# Altium schematic sheet Sheet1.SchDoc
size A4; SheetNumber: 1; SheetTotal: 1
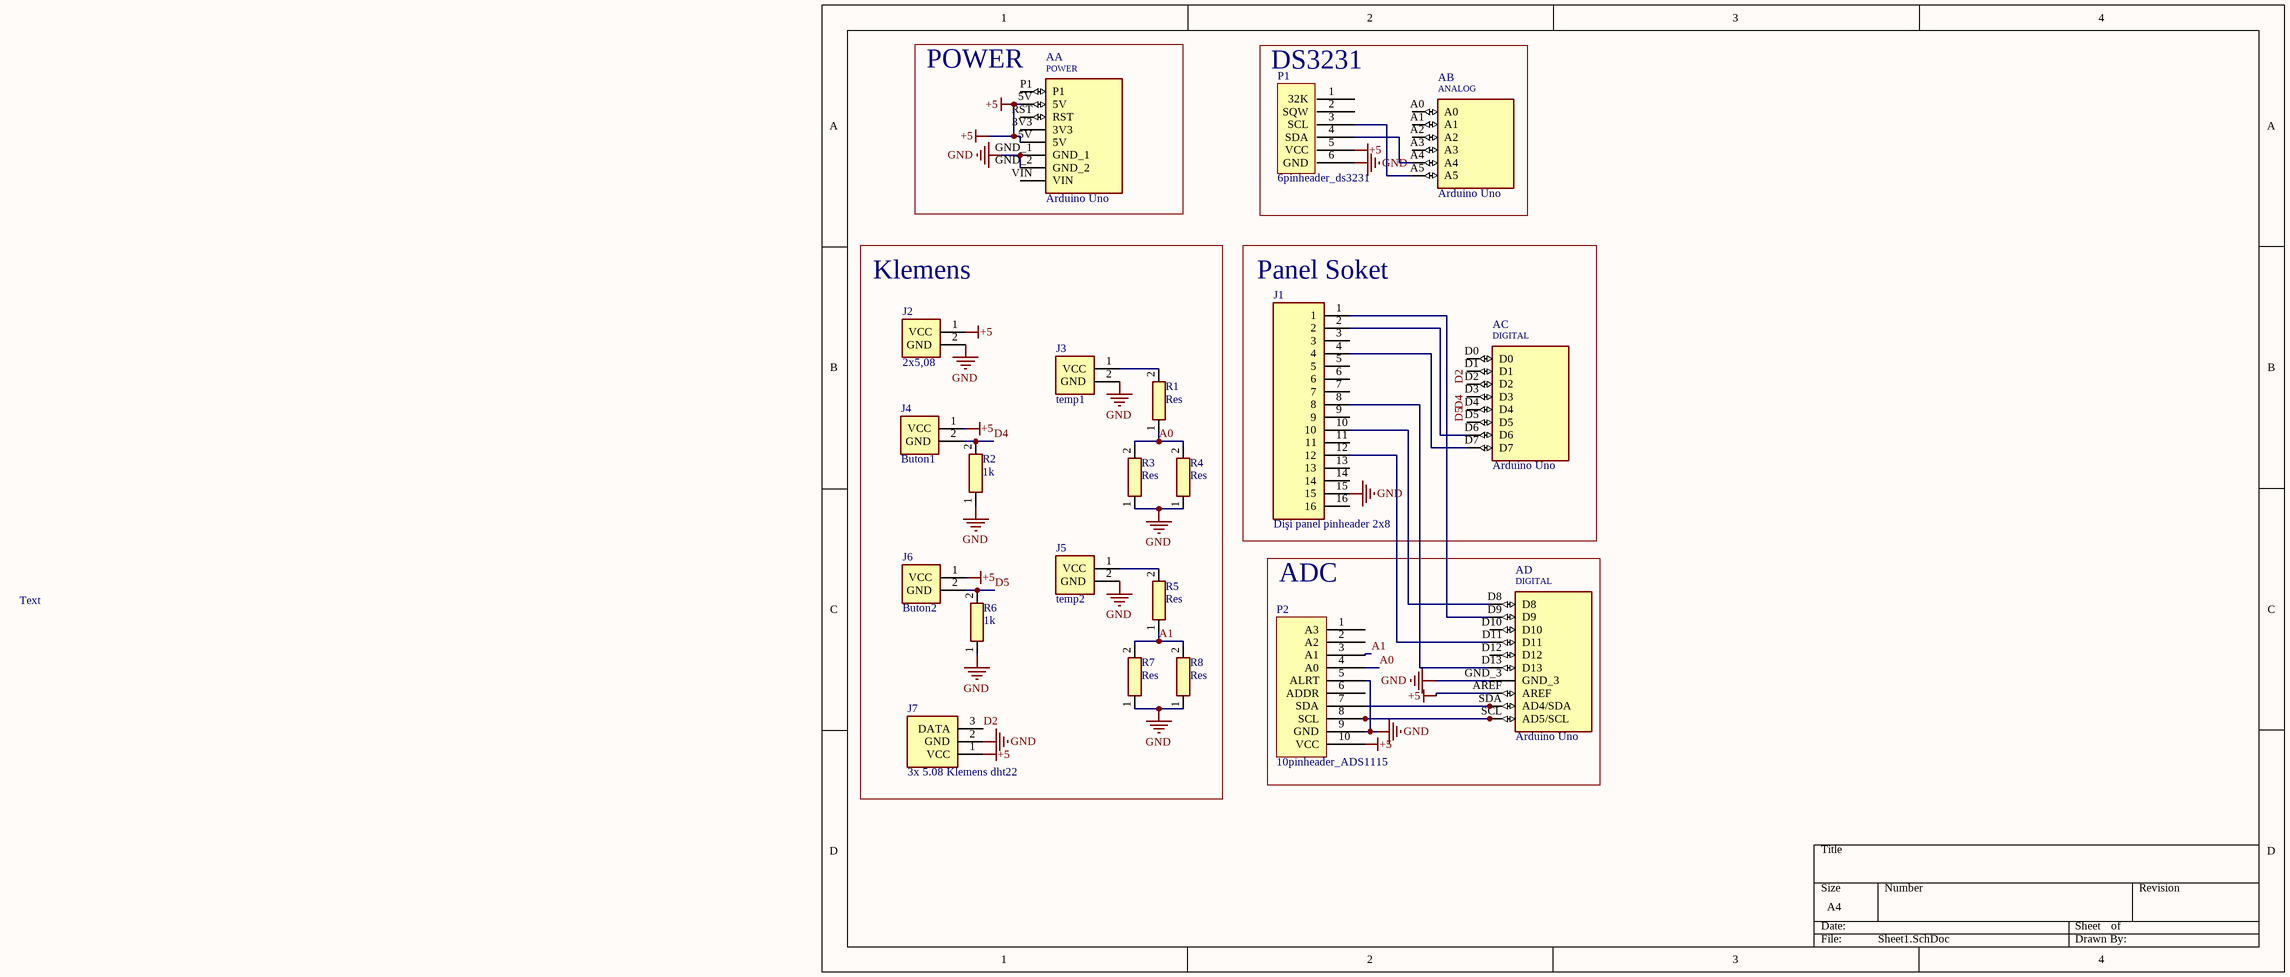
[diagram p0: Sheet1.SchDoc]

## Parts
A  Arduino Uno  [ARDUINO_A000066]  (parts A,B,C,D of 4)
J1  Dişi panel pinheader 2x8  [Dişi panel pinheader 2x8]
J2  2x5,08  [2x5,08]
J3  temp1  [2x5,08]
J4  Buton1  [2x5,08]
J5  temp2  [2x5,08]
J6  Buton2  [2x5,08]
J7  3x 5.08 Klemens dht22  [3x 5.08 klemens]
P1  6pinheader_ds3231  [6pinheader_ds3231]
P2  10pinheader_ADS1115  [10xHeaderAD725-1]
R1  Res  [10k resistor]
R2  1k  [10k resistor]
R3  Res  [10k resistor]
R4  Res  [10k resistor]
R5  Res  [10k resistor]
R6  1k  [10k resistor]
R7  Res  [10k resistor]
R8  Res  [10k resistor]

## Blocks framed on the sheet
POWER: A
DS3231: A P1
Klemens: J2-J7 R1-R8
Panel Soket: A J1
ADC: A P2

## Nets
+5: A.5V A.AREF J2.1(VCC) J4.1(VCC) J6.1(VCC) J7.1(VCC) P1.5(VCC) P2.10(VCC)
GND: A.GND_1 A.GND_2 A.GND_3 J1.15 J2.2(GND) J3.2(GND) J5.2(GND) J7.2(GND) P1.6(GND) P2.5(ALRT) P2.9(GND) R2.1 R3.1 R4.1 R6.1 R7.1 R8.1
A0: P2.4(A0) R1.1 R3.2 R4.2
A1: P2.3(A1) R5.1 R7.2 R8.2
D2: A.D2 J7.3(DATA)
D4: A.D4 J4.2(GND) R2.2
D5: A.D5 J6.2(GND) R6.2
NetA_A4: A.A4 P1.4(SDA)
NetA_A5: A.A5 P1.3(SCL)
NetA_D6: A.D6 J1.2
NetA_D7: A.D7 J1.4
NetA_D8: A.D8 J1.10
NetA_D9: A.D9 J1.1
NetA_D11: A.D11 J1.12
NetA_D13: A.D13 J1.8
NetA_SCL: A.SCL(AD5/SCL) P2.8(SCL)
NetA_SDA: A.SDA(AD4/SDA) P2.7(SDA)
NetJ3_1: J3.1(VCC) R1.2
NetJ5_1: J5.1(VCC) R5.2

Not connected (* = marked no-connect by the designer): A 3V3 A0 A1 A2 A3 D0 D1 D3 D10 D12 P1 RST VIN; J1 3 5 6 7 9 11 13 14 16; P1 1(32K) 2(SQW); P2 1(A3) 2(A2) 6(ADDR)

## Notes on the sheet
- Text
- (in symbol Arduino Uno, part A) POWER
- (in symbol Arduino Uno, part B) ANALOG
- (in symbol Arduino Uno, part C) DIGITAL
- (in symbol Arduino Uno, part D) DIGITAL

## Library data of the parts
A = Arduino Uno: ATmega328P Arduino Uno R3 AVRÂ® ATmega AVR MCU 8-Bit Embedded Evaluation Board; MP: A000066; Value: *; Package: None; MF: Arduino; Price: None; Availability: Unavailable; SnapEDA_Link: https://www.snapeda.com/parts/A000066/Arduino/view-part/557638/?ref=snap
J1 = Dişi panel pinheader 2x8: IDC LOW PRO HDR 50P VERT HT BLACK; MP: 1761681-6; Package: None; Price: None; Value: *; Availability: Unavailable
J2-J6 = 2x5,08: TERMINAL BLOCK,HEADER, 5.08 MM, 2WAY; Product Range:-; Gender:Header; MF: TE Connectivity; MP: 282814-2; EU_RoHS_Compliance: Compliant; SnapEDA_Link: https://www.snapeda.com/parts/282814-2/TE%20Connectivity%20AMP%20Connectors/view-part/2381383/?ref=snap; Availability: Unavailable; Price: None; Package: None; TE_purchase_URL: https://www.te.com/usa-en/product-282814-2.html?te_bu=Cor&te_type=disp&te_campaign=seda_glo_cor-seda-global-disp-prtnr-fy19-seda-model-bom-cta_sma-317_1&elqCampaignId=32493; Value: *
J7 = 3x 5.08 Klemens dht22: 2~24 Poles, Screw Type, Horizontal, 5.08 Pitch, 26~14 _AWG_, Terminal Block Connector; MF: CUI Devices; MP: TB006-508-03BE; Value: *; Price: None; Availability: Unavailable; SnapEDA_Link: https://www.snapeda.com/parts/TB006-508-03BE/CUI%20Devices/view-part/3591102/?ref=snap; CUI_purchase_URL: https://www.cuidevices.com/product/interconnect/connectors/terminal-blocks/tb006-508-series?utm_source=snapeda.com&utm_medium=referral&utm_campaign=snapedaBOM; Package: None
R1-R8 = Res: Resistor; Manufacturer_Name: Vishay; Manufacturer_Part_Number: CRCW120610K0DHEAP; Datasheet Link: http://componentsearchengine.com/Datasheets/1/CRCW120610K0DHEAP.pdf; Height: 0.6mm; Mouser Part Number: 71-CRCW120610K0DHEAP; Mouser Price/Stock: https://www.mouser.co.uk/ProductDetail/Vishay-Dale/CRCW120610K0DHEAP?qs=4BdzfeD6%252Bt0oQlLvLz8F%2Fg%3D%3D; Arrow Part Number: CRCW120610K0DHEAP; Arrow Price/Stock: https://www.arrow.com/en/products/crcw120610k0dheap/vishay